# EAGLE design SmartMirror8085 (EAGLE 8.4.3)
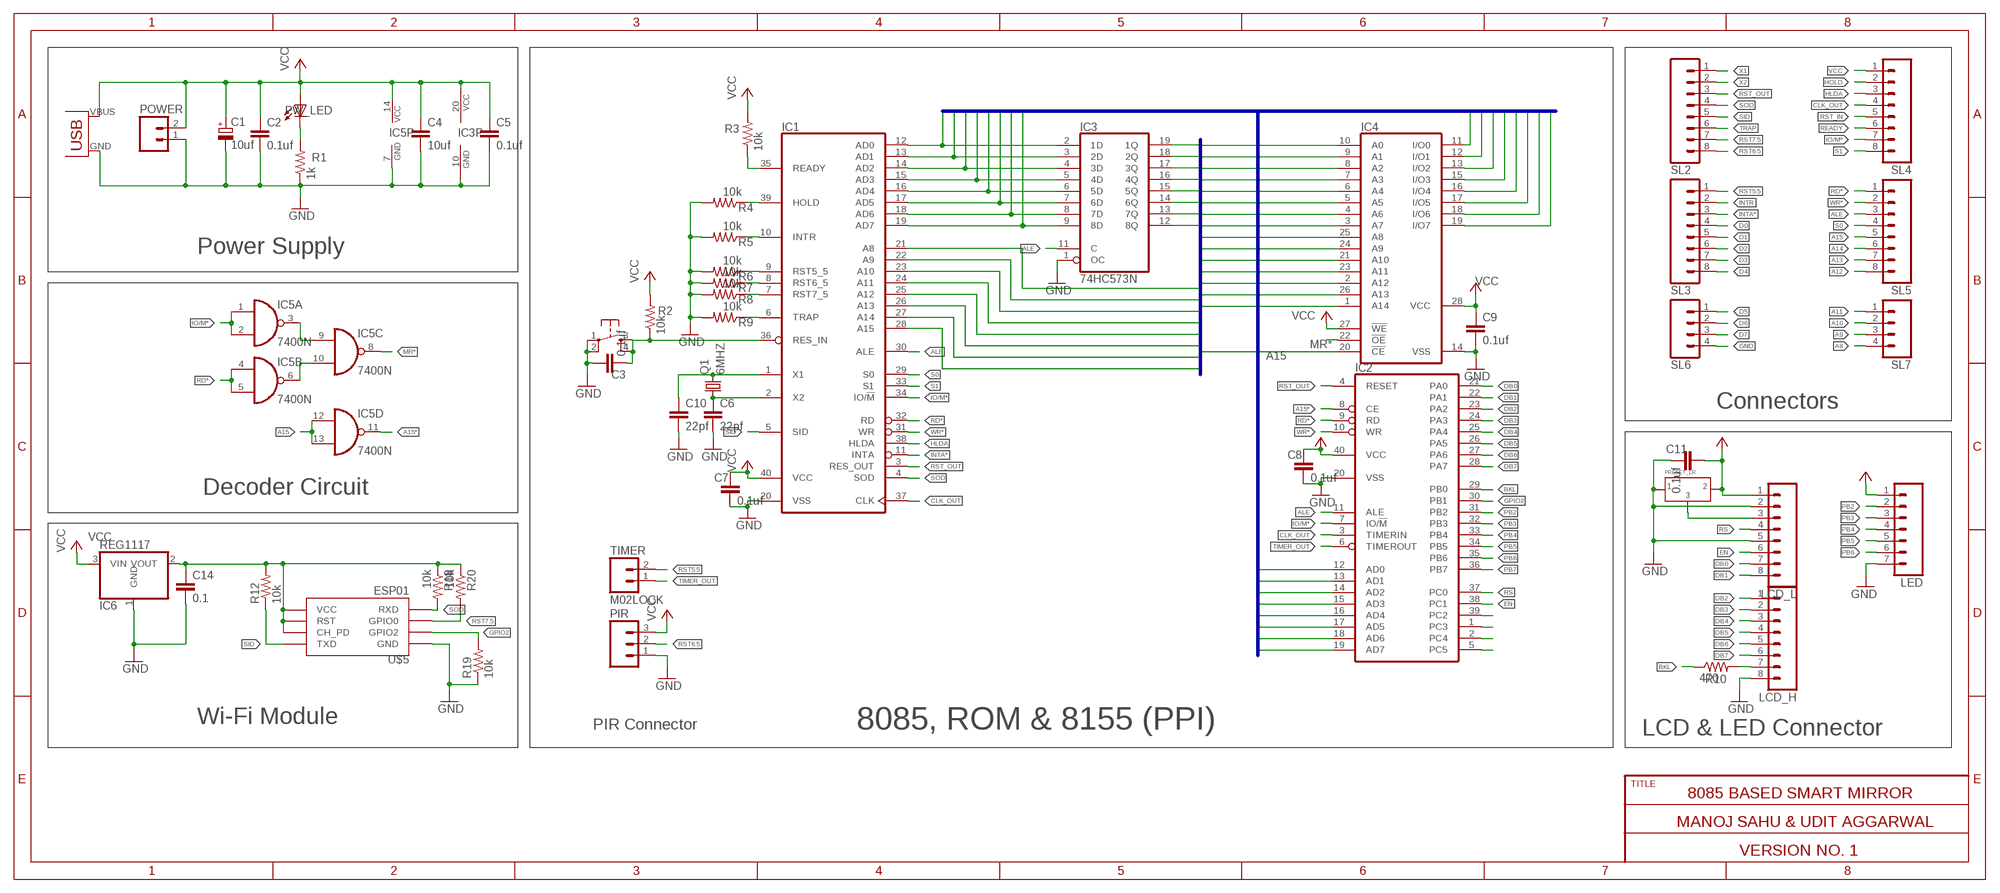
[diagram p0: schematic, sheet 1]

## Parts
C1  10uf  CPOL-EUE5-8.5  [E5-8,5]
C2  0.1uf  C-EU025-024X044  [C025-024X044]
C3  0.1uf  C-EU025-024X044  [C025-024X044]
C4  10uf  C-EU025-024X044  [C025-024X044]
C5  0.1uf  C-EU025-024X044  [C025-024X044]
C6  22pf  C-EU025-024X044  [C025-024X044]
C7  0.1uf  C-EU025-024X044  [C025-024X044]
C8  0.1uf  C-EU025-024X044  [C025-024X044]
C9  0.1uf  C-EU025-024X044  [C025-024X044]
C10  22pf  C-EU025-024X044  [C025-024X044]
C11  0.1uf  C-EU025-024X044  [C025-024X044]
C14  0.1  C-EU025-024X044  [C025-024X044]
IC1  8085  [DIL40]
IC2  8155  [DIL40]
IC3  74HC573N  [DIL20]
IC4  58C256P  [DIL28-6]
IC5  7400N  [DIL14]
IC6  REG1117  [SOT223]
LCD_H  M08  [08P]
LCD_L  M08  [08P]
LED  M07  [07P]
PIR  M03  [03P]
POWER  M02  [02P]
PW_LED  LED3MM  [LED3MM]
Q1  6MHZ  CRYSTALHC49US  [HC49US]
R1  1k  RESISTOR0207/7  [0207/7]
R2  10k  RESISTOR0207/7  [0207/7]
R3  10k  RESISTOR0207/7  [0207/7]
R4  10k  RESISTOR0207/7  [0207/7]
R5  10k  RESISTOR0207/7  [0207/7]
R6  10k  RESISTOR0207/7  [0207/7]
R7  10k  RESISTOR0207/7  [0207/7]
R8  10k  RESISTOR0207/7  [0207/7]
R9  10k  RESISTOR0207/7  [0207/7]
R10  470  RESISTOR0207/7  [0207/7]
R12  10k  R-US_0207/7  [0207/7]
R18  10k  R-US_0207/7  [0207/7]
R19  10k  R-US_0207/7  [0207/7]
R20  10k  R-US_0207/7  [0207/7]
RESET  OMRON_SWITCH_10-XX  [B3F-10XX]
SL2  M08  [08P]
SL3  M08  [08P]
SL4  M08  [08P]
SL5  M08  [08P]
SL6  M04  [04P]
SL7  M04  [04P]
TIMER  M02LOCK  [1X02_LOCK]
U$2  USB(POWER)  [USB(POWER)]
U$3  PRESET_LR  [PRESET_LR]
U$5  ESP01  [ESP01]

## Nets
3V3: C14.1 IC6.2(VOUT) R12.2 R18.1 R20.1 U$5.CH_PD U$5.RST U$5.VCC
A0: IC3.19(1Q) IC4.10(A0)
A1: IC3.18(2Q) IC4.9(A1)
A2: IC3.17(3Q) IC4.8(A2)
A3: IC3.16(4Q) IC4.7(A3)
A4: IC3.15(5Q) IC4.6(A4)
A5: IC3.14(6Q) IC4.5(A5)
A6: IC3.13(7Q) IC4.4(A6)
A7: IC3.12(8Q) IC4.3(A7)
A8: IC1.21(A8) IC4.25(A8) SL7.4
A9: IC1.22(A9) IC4.24(A9) SL7.3
A10: IC1.23(A10) IC4.21(A10) SL7.2
A11: IC1.24(A11) IC4.23(A11) SL7.1
A12: IC1.25(A12) IC4.2(A12) SL5.8
A13: IC1.26(A13) IC4.26(A13) SL5.7
A14: IC1.27(A14) IC4.1(A14) SL5.6
A15: IC1.28(A15) IC4.20(!CE) IC5.12(D:I0) IC5.13(D:I1) SL5.5
A15*: IC2.8(CE) IC5.11(D:O)
ALE: IC1.30(ALE) IC2.11(ALE) IC3.11(C) SL5.3
BKL: IC2.29(PB0) R10.1
CLK_OUT: IC1.37(CLK) IC2.3(TIMERIN) SL4.4
D0: IC1.12(AD0) IC2.12(AD0) IC3.2(1D) IC4.11(I/O0) SL3.4
D1: IC1.13(AD1) IC2.13(AD1) IC3.3(2D) IC4.12(I/O1) SL3.5
D2: IC1.14(AD2) IC2.14(AD2) IC3.4(3D) IC4.13(I/O2) SL3.6
D3: IC1.15(AD3) IC2.15(AD3) IC3.5(4D) IC4.15(I/O3) SL3.7
D4: IC1.16(AD4) IC2.16(AD4) IC3.6(5D) IC4.16(I/O4) SL3.8
D5: IC1.17(AD5) IC2.17(AD5) IC3.7(6D) IC4.17(I/O5) SL6.1
D6: IC1.18(AD6) IC2.18(AD6) IC3.8(7D) IC4.18(I/O6) SL6.2
D7: IC1.19(AD7) IC2.19(AD7) IC3.9(8D) IC4.19(I/O7) SL6.3
DB0: IC2.21(PA0) LCD_L.7
DB1: IC2.22(PA1) LCD_L.8
DB2: IC2.23(PA2) LCD_H.1
DB3: IC2.24(PA3) LCD_H.2
DB4: IC2.25(PA4) LCD_H.3
DB5: IC2.26(PA5) LCD_H.4
DB6: IC2.27(PA6) LCD_H.5
DB7: IC2.28(PA7) LCD_H.6
EN: IC2.38(PC1) LCD_L.6
GND: C1.- C2.2 C3.1 C4.2 C5.2 C6.2 C7.2 C8.2 C9.2 C10.2 C11.2 C14.2 IC1.20(VSS) IC2.20(VSS) IC3.1(OC) IC3.10(GND) IC4.14(VSS) IC5.7(P:GND) IC6.1(GND) LCD_H.8 LCD_L.2 LCD_L.5 LED.7 PIR.1 POWER.1 R1.1 R4.2 R5.2 R6.2 R7.2 R8.2 R9.2 R19.1 RESET.1(P) RESET.2(P1) SL6.4 U$2.GND U$3.P$1 U$5.GND
GPIO2: IC2.30(PB1) R19.2 U$5.GPIO2
HLDA: IC1.38(HLDA) SL4.3
HOLD: IC1.39(HOLD) R4.1 SL4.2
INTA*: IC1.11(INTA) SL3.3
INTR: IC1.10(INTR) R5.1 SL3.2
IO/M*: IC1.34(IO/!M) IC2.7(IO/!M) IC5.1(A:I0) IC5.2(A:I1) SL4.7
MR*: IC4.22(!OE) IC5.8(C:O)
N$1: IC2.39(PC2)
N$2: LCD_L.3 U$3.P$3
N$3: IC2.1(PC3)
N$4: LCD_H.7 R10.2
N$7: PW_LED.K(C) R1.2
N$8: IC5.3(A:O) IC5.9(C:I0)
N$9: IC5.6(B:O) IC5.10(C:I1)
N$21: IC2.2(PC4)
N$22: IC2.5(PC5)
PB2: IC2.31(PB2) LED.2
PB3: IC2.32(PB3) LED.3
PB4: IC2.33(PB4) LED.4
PB5: IC2.34(PB5) LED.5
PB6: IC2.35(PB6) LED.6
PB7: IC2.36(PB7)
RD*: IC1.32(RD) IC2.9(RD) IC5.4(B:I0) IC5.5(B:I1) SL5.1
READY: IC1.35(READY) R3.1 SL4.6
RS: IC2.37(PC0) LCD_L.4
RST5.5: IC1.9(RST5_5) R6.1 SL3.1 TIMER.2
RST6.5: IC1.8(RST6_5) PIR.2 R7.1 SL2.8
RST7.5: IC1.7(RST7_5) R8.1 R20.2 SL2.7 U$5.GPIO0
RST_IN: C3.2 IC1.36(RES_IN) R2.1 RESET.3(S) RESET.4(S1) SL4.5
RST_OUT: IC1.3(RES_OUT) IC2.4(RESET) SL2.3
S0: IC1.29(S0) SL5.4
S1: IC1.33(S1) SL4.8
SID: IC1.5(SID) R12.1 SL2.5 U$5.TX(TXD)
SOD: IC1.4(SOD) R18.2 SL2.4 U$5.RX(RXD)
TIMER_OUT: IC2.6(TIMEROUT) TIMER.1
TRAP: IC1.6(TRAP) R9.1 SL2.6
VCC: C1.+ C2.1 C4.1 C5.1 C7.1 C8.1 C9.1 C11.1 IC1.40(VCC) IC2.40(VCC) IC3.20(VCC) IC4.27(!WE) IC4.28(VCC) IC5.14(P:VCC) IC6.3(VIN) LCD_L.1 LED.1 PIR.3 POWER.2 PW_LED.A R2.2 R3.2 SL4.1 U$2.VBUS(VCC) U$3.P$2
WR*: IC1.31(WR) IC2.10(WR) SL5.2
X1: C10.1 IC1.1(X1) Q1.2 SL2.1
X2: C6.1 IC1.2(X2) Q1.1 SL2.2

## Buses
D[0..7]
A[0..15]

## Notes on the sheet
- Power Supply
- Connectors
- Decoder Circuit
- Wi-Fi Module
- PIR Connector | 8085, ROM & 8155 (PPI)
- LCD & LED Connector
- TITLE
- 8085 BASED SMART MIRROR
- MANOJ SAHU & UDIT AGGARWAL
- VERSION NO. 1

## Library data of the parts
C1 = rcl:CPOL-EU: POLARIZED CAPACITOR, European symbol
C2-C11 C14 = rcl:C-EU: CAPACITOR, European symbol
IC1 = micro-intel:8085: MICROCOMPUTER/PERIPHERAL DEVICE; OC_FARNELL: unknown; OC_NEWARK: unknown
IC2 = micro-intel:8155: MICROCOMPUTER/PERIPHERAL DEVICE; OC_FARNELL: unknown; OC_NEWARK: unknown
IC3 = 74xx-us:74*573: 8-bit D latch BUS DRIVER
IC4 = memory-hitachi:58C256P: MEMORY; MPN: HN58C256AP85E; OC_FARNELL: 1496447; OC_NEWARK: 61M6616
IC5 = 74xx-eu:74*00: Quad 2-input NAND gate
IC6 = CEDT_JANUARY_2015_v5:REG1117: 800mA and 1A Low Dropout (LDO) Positive Regulator 1.8V, 2.5V, 2.85V, 3.3V, 5V, and Adj
LCD_H LCD_L SL2-SL5 = con-amp-quick:M08: AMP QUICK CONNECTOR; OC_FARNELL: unknown; OC_NEWARK: unknown
LED = con-amp-quick:M07: AMP QUICK CONNECTOR; OC_FARNELL: unknown; OC_NEWARK: unknown
PIR = con-amp-quick:M03: AMP QUICK CONNECTOR; OC_FARNELL: unknown; OC_NEWARK: unknown
POWER = CEDT_JANUARY_2015_v7:M02: AMP QUICK CONNECTOR
PW_LED = CEDT_JANUARY_2015_v7:LED
Q1 = CEDT_JANUARY_2015_v7:CRYSTAL: Crystals Various standard crystals. Proven footprints. Spark Fun Electronics SKU : COM-00534
R1-R10 = CEDT_JANUARY_2015_v7:RESISTOR
R12 R18-R20 = rcl:R-US_: RESISTOR, American symbol
RESET = CEDT_JANUARY_2015_v7:OMRON_SWITCH
SL6 SL7 = con-amp-quick:M04: AMP QUICK CONNECTOR; OC_FARNELL: unknown; OC_NEWARK: unknown
TIMER = SparkFun-Connectors:M02: Standard 2-pin 0.1" header. Use with - straight break away headers ( PRT-00116) - right angle break away headers (PRT-00553) - swiss pins (PRT-00743) - machine pins (PRT-00117) - female headers (PRT-00115) Molex polarized connector foot print use with: PRT-08233 with associated crimp pins and housings. 2.54_SCREWTERM for use with PRT-10571. 3.5mm Screw Terminal footprints for PRT-08084 5mm Screw Terminal footprints for use with PRT-08432
U$2 = CEDT_JANUARY_2015_v7:USB(POWER)
U$3 = CEDT_JANUARY_2015_v7:PRESET_LR
U$5 = esp8266modules:ESP01: ESP8266 Wifi module 01

## Net classes
0 default: width 0.406 mm, clearance 0.305 mm
1 VCC: width 0.61 mm, clearance 0.305 mm to class 0, clearance 0.305 mm
2 GND: width 0.61 mm, clearance 0.305 mm to class 0, clearance 0.305 mm to class 1, clearance 0.305 mm

## Board
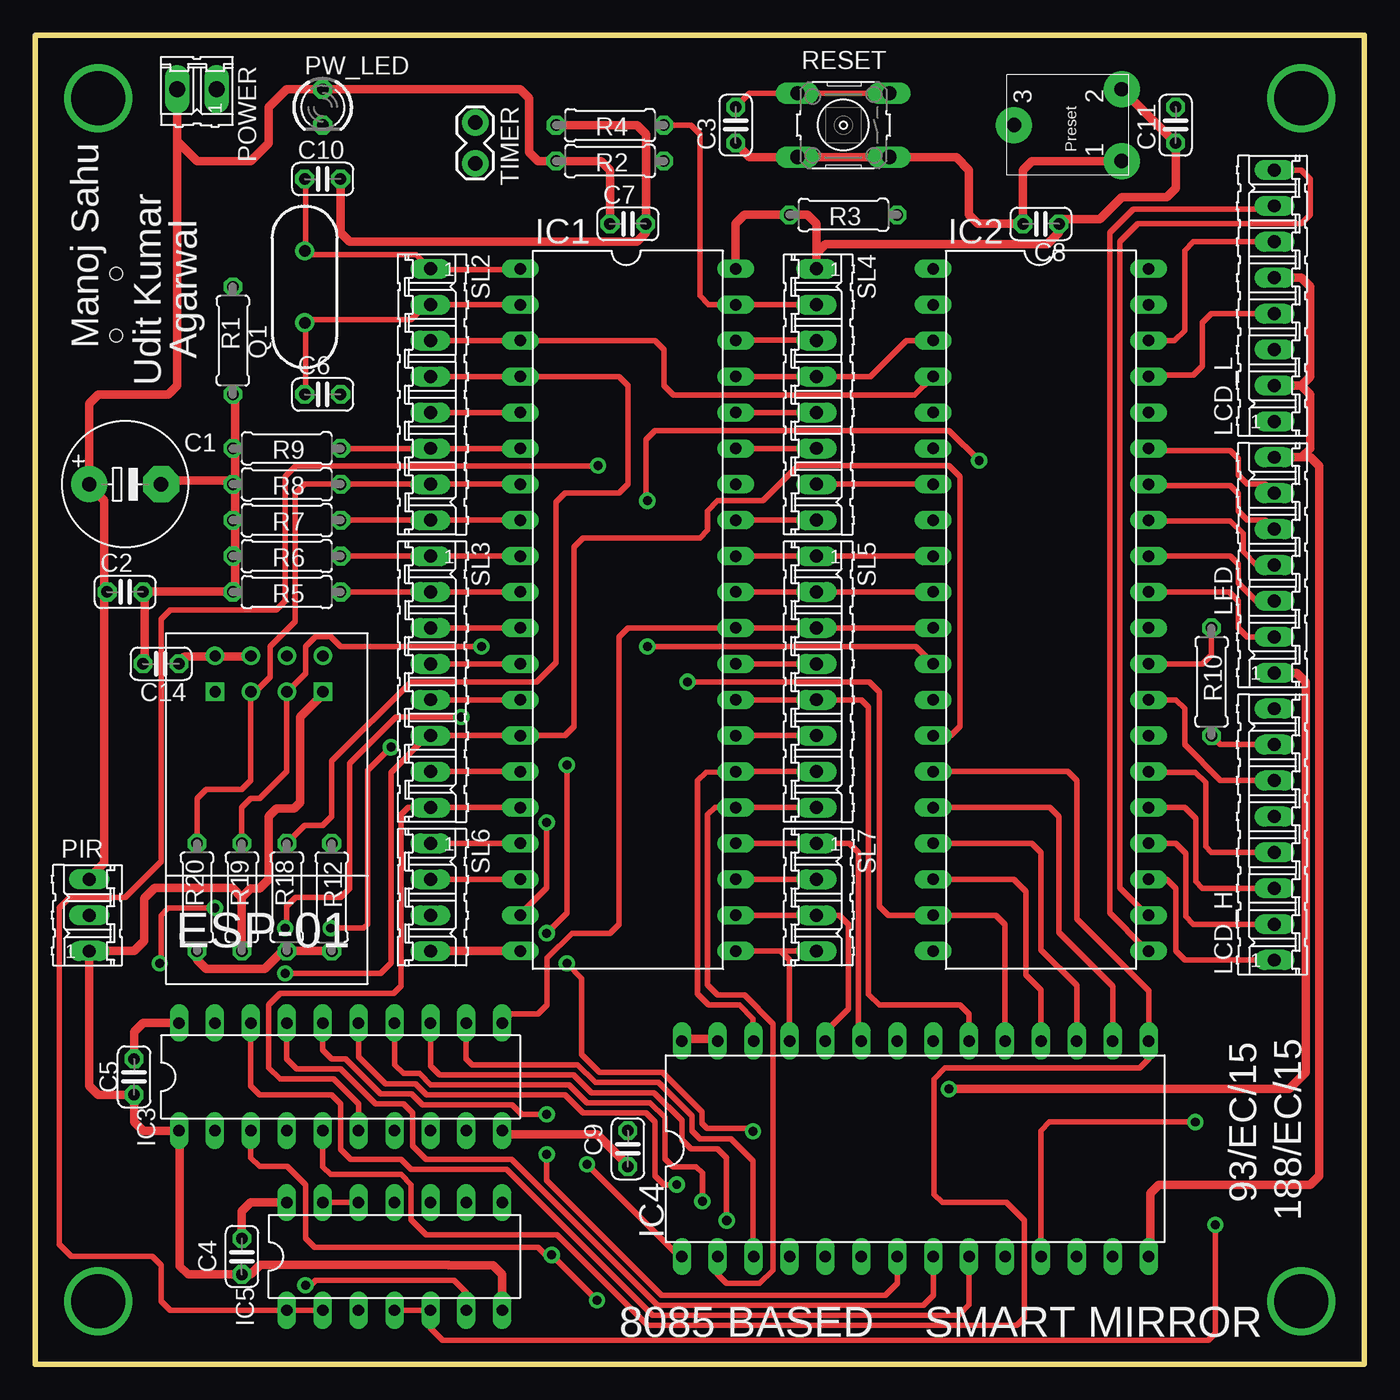
[diagram p1: board, top side]
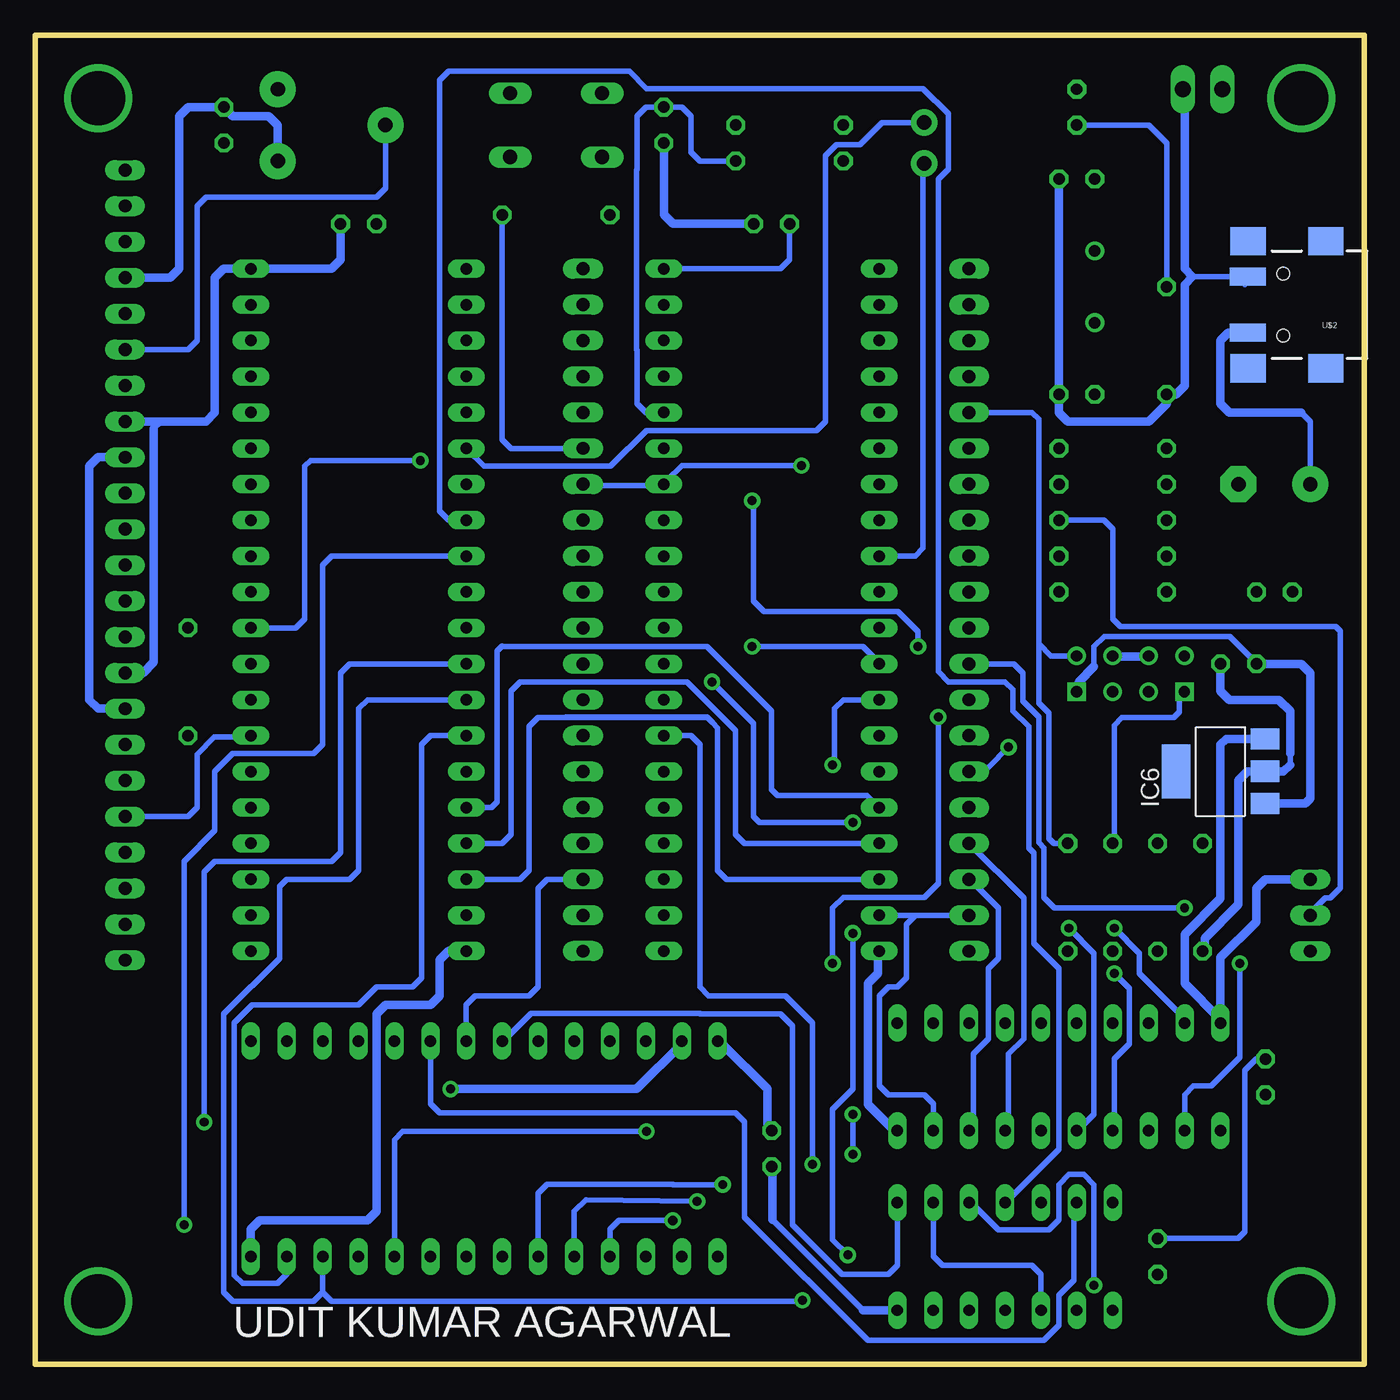
[diagram p2: board, bottom side, seen from below]

Size 93.98 x 93.98 mm. Coordinates in mm from the lower left corner, seen from the top.
Outline: 0,0 0,93.98 93.98,93.98 93.98,0 0,0
Copper layers (1*16): Top 0.035mm / dielectric 1.5mm / Bottom 0.035mm
Design rules "drcsetting": minimum track width 12mil, minimum drill 25mil, track to track 8mil, track to pad 8mil, pad to pad 8mil, via to via 8mil, smd to smd 8mil, copper to edge 40mil, drill to drill 12mil, minimum pad ring 10mil, minimum via ring 10mil, stop-mask expansion 4mil, vias tented up to drill 0mil, thermal gap 10mil

### Footprints (pad centres in the part's own frame; a part is rotated, then mirrored left to right if it is on the bottom)
E5-8,5 = drill 1.016 pad 2.54: + -2.54,0 | drill 1.016 pad 2.54 octagon: - 2.54,0
C025-024X044 = drill 0.813 octagon: 1 -1.27,0; 2 1.27,0
DIL40 = drill 0.813 long: 1 -24.13,-7.62; 2 -21.59,-7.62; 3 -19.05,-7.62; 4 -16.51,-7.62; 5 -13.97,-7.62; 6 -11.43,-7.62; 7 -8.89,-7.62; 8 -6.35,-7.62; 9 -3.81,-7.62; 10 -1.27,-7.62; 11 1.27,-7.62; 12 3.81,-7.62; 13 6.35,-7.62; 14 8.89,-7.62; 15 11.43,-7.62; 16 13.97,-7.62; 17 16.51,-7.62; 18 19.05,-7.62; 19 21.59,-7.62; 20 24.13,-7.62; 21 24.13,7.62; 22 21.59,7.62; 23 19.05,7.62; 24 16.51,7.62; 25 13.97,7.62; 26 11.43,7.62; 27 8.89,7.62; 28 6.35,7.62; 29 3.81,7.62; 30 1.27,7.62; 31 -1.27,7.62; 32 -3.81,7.62; 33 -6.35,7.62; 34 -8.89,7.62; 35 -11.43,7.62; 36 -13.97,7.62; 37 -16.51,7.62; 38 -19.05,7.62; 39 -21.59,7.62; 40 -24.13,7.62
DIL20 = drill 0.813 long: 1 -11.43,-3.81; 2 -8.89,-3.81; 3 -6.35,-3.81; 4 -3.81,-3.81; 5 -1.27,-3.81; 6 1.27,-3.81; 7 3.81,-3.81; 8 6.35,-3.81; 9 8.89,-3.81; 10 11.43,-3.81; 11 11.43,3.81; 12 8.89,3.81; 13 6.35,3.81; 14 3.81,3.81; 15 1.27,3.81; 16 -1.27,3.81; 17 -3.81,3.81; 18 -6.35,3.81; 19 -8.89,3.81; 20 -11.43,3.81
DIL28-6 = drill 0.813 long: 1 -16.51,-7.62; 2 -13.97,-7.62; 3 -11.43,-7.62; 4 -8.89,-7.62; 5 -6.35,-7.62; 6 -3.81,-7.62; 7 -1.27,-7.62; 8 1.27,-7.62; 9 3.81,-7.62; 10 6.35,-7.62; 11 8.89,-7.62; 12 11.43,-7.62; 13 13.97,-7.62; 14 16.51,-7.62; 15 16.51,7.62; 16 13.97,7.62; 17 11.43,7.62; 18 8.89,7.62; 19 6.35,7.62; 20 3.81,7.62; 21 1.27,7.62; 22 -1.27,7.62; 23 -3.81,7.62; 24 -6.35,7.62; 25 -8.89,7.62; 26 -11.43,7.62; 27 -13.97,7.62; 28 -16.51,7.62
DIL14 = drill 0.813 long: 1 -7.62,-3.81; 2 -5.08,-3.81; 3 -2.54,-3.81; 4 0,-3.81; 5 2.54,-3.81; 6 5.08,-3.81; 7 7.62,-3.81; 8 7.62,3.81; 9 5.08,3.81; 10 2.54,3.81; 11 0,3.81; 12 -2.54,3.81; 13 -5.08,3.81; 14 -7.62,3.81
SOT223 = smd 1.499 x 2.007: 1 -2.261,-3.15; 2 0.025,-3.15; 3 2.311,-3.15 | smd 3.81 x 2.007: 4 0,3.15
08P = drill 0.914 long: 1 -8.89,0; 2 -6.35,0; 3 -3.81,0; 4 -1.27,0; 5 1.27,0; 6 3.81,0; 7 6.35,0; 8 8.89,0
07P = drill 0.914 long: 1 -7.62,0; 2 -5.08,0; 3 -2.54,0; 4 0,0; 5 2.54,0; 6 5.08,0; 7 7.62,0
03P = drill 0.914 long: 1 -2.54,0; 2 0,0; 3 2.54,0
02P = drill 1.143 long: 1 -1.397,0; 2 1.397,0
LED3MM = drill 0.813 octagon: A -1.27,0; K 1.27,0
HC49US = drill 0.813: 1 -2.54,0; 2 2.54,0
0207/7 = drill 0.813 octagon: 1 -3.81,0; 2 3.81,0
B3F-10XX = drill 1.016 long: 1 -3.251,2.261; 2 3.251,2.261; 3 -3.251,-2.261; 4 3.251,-2.261
04P = drill 0.914 long: 1 -3.81,0; 2 -1.27,0; 3 1.27,0; 4 3.81,0
1X02_LOCK = drill 1.016 pad 1.88: 1 -0.178,0; 2 2.718,0
USB(POWER) = smd 2.54 x 1.27: GND 2.5,-1.981; VBUS 2.5,1.981 | smd 2.5 x 2: GND@1 -3,-4.5; GND@2 -3,4.5; GND@3 2.5,4.5; GND@4 2.5,-4.5 | hole 0.9: 0,2.2; 0,-2.2
PRESET_LR = drill 1.016 pad 2.54: P$1 -2.54,-3.81; P$2 2.54,-3.81; P$3 0,3.81
ESP01 = drill 0.8: CH_PD -1.285,-8.178; GPIO0 1.255,-5.638; GPIO2 -1.285,-5.638; RST 1.255,-8.178; TX -3.825,-8.178; VCC 3.795,-8.178 | drill 0.8 square: GND -3.825,-5.638; RX 3.795,-5.638

### Placement (x,y rotation side)
C1  6.35,62.23 0 top
C2  6.35,54.61 0 top
C3  49.53,87.63 90 top
C4  14.61,7.62 270 top
C5  6.99,20.32 270 top
C6  20.32,68.58 0 top
C7  41.91,80.64 0 top
C8  71.12,80.64 180 top
C9  41.91,15.24 270 top
C10  20.32,83.82 0 top
C11  80.64,87.63 90 top
C14  8.89,49.53 180 top
IC1  41.91,53.34 270 top
IC2  71.12,53.34 270 top
IC3  21.59,20.32 0 top
IC4  62.23,15.24 0 top
IC5  25.4,7.62 0 top
IC6  10.16,41.91 90 bottom
LCD_H  87.63,37.47 90 top
LCD_L  87.63,75.56 90 top
LED  87.63,56.52 90 top
PIR  3.81,31.75 90 top
POWER  11.43,90.17 180 top
PW_LED  20.32,88.9 270 top
Q1  19.05,76.2 90 top
R1  13.97,72.39 90 top
R2  40.64,85.09 180 top
R3  57.15,81.28 180 top
R4  40.64,87.63 180 top
R5  17.78,54.61 180 top
R6  17.78,57.15 180 top
R7  17.78,59.69 180 top
R8  17.78,62.23 180 top
R9  17.78,64.77 180 top
R10  83.19,48.26 270 top
R12  20.95,33.02 270 top
R18  17.78,33.02 90 top
R19  14.61,33.02 90 top
R20  11.43,33.02 90 top
RESET  57.15,87.63 180 top
SL2  27.94,68.58 270 top
SL3  27.94,48.26 270 top
SL4  55.24,68.58 270 top
SL5  55.24,48.26 270 top
SL6  27.94,33.02 270 top
SL7  55.24,33.02 270 top
TIMER  31.11,87.63 270 top
U$2  5.71,74.93 180 bottom
U$3  73.03,87.63 90 top
U$5  16.51,41.91 180 top

### Tracks (layer width: path | path; a pad name or v marks a point on that pad's centre or on a via)
3V3
  Top 0.406: 12.7,50.04 U$5.VCC | R18.1 17.48,29.21
  Top 0.61: U$5.VCC 13.06,50.04 15.19,50.04 U$5.RST | 12.7,50.04 10.57,50.04 10.21,49.68 C14.1 | R20.1 11.43,28.57 12.06,27.94 16.2,27.94 17.48,29.21 | R18.1 R12.2
  Bottom 0.406: 17.68,50.04 U$5.CH_PD | 15.54,50.04 U$5.RST | 6.3,42.22 7.01,42.22 IC6.2 7.04,41.91 | 5.23,42.39 5.23,43.18 5.24,43.19
  Bottom 0.61: 15.54,50.04 17.68,50.04 | R20.1 11.28,29.41 11.28,30.12 8.89,32.51 8.89,41.27 8.26,41.91 7.04,41.91 5.71,41.91 5.23,42.39 | C14.1 10.16,47.62 9.53,46.99 6.04,46.99 5.24,46.2 5.24,43.19
A0  (via drill 0.64)
  Top 0.406: v30.12,45.77 25.5,45.77 22.23,42.49 22.23,33.66 21.59,33.02 18.41,33.02 17.78,32.38 17.78,30.94 v17.68,30.84 | v50.75,16.46 50.55,16.66 47.5,16.66 47.14,17.02 47.14,17.84 44.36,20.62 39.91,20.62 38.64,21.89 38.64,27.3 v37.59,28.35
  Bottom 0.406: v17.68,30.84 15.9,29.06 15.9,27.64 12.7,24.43 IC3.19 | v30.12,45.77 30.12,34.01 31.11,33.02 36.83,33.02 37.59,32.26 v37.59,28.35 | IC4.10 68.58,15.88 68,16.46 v50.75,16.46
A1
  Top 0.406: IC4.9 66.04,4.19 65.3,3.45 43.64,3.45 33.33,13.77 26.57,13.77 25.86,14.48 22.3,14.48 21.59,15.19 21.59,18.41 20.95,19.05 15.88,19.05 15.24,19.68 IC3.18
A2
  Top 0.406: IC3.17 17.78,21.59 18.49,20.88 21.59,20.88 24.05,18.41 26.04,18.41 26.67,17.78 26.67,15.44 27.64,14.48 33.68,14.48 43.99,4.17 62.8,4.17 63.5,4.86 IC4.8
A3  (via drill 0.64)
  Top 0.406: v36.17,17.68 34.39,17.68 33.73,18.34 27.38,18.34 26.59,19.13 24.43,19.13 21.96,21.59 20.95,21.59 20.32,22.23 IC3.16 | IC4.7 60.96,5.71 60.12,4.88 44.29,4.88 36.17,12.99 v36.17,14.83
  Bottom 0.406: v36.17,17.68 v36.17,14.83
A4  (via drill 0.64)
  Top 0.406: 22.86,22.86 IC3.15 22.86,21.74 24.77,19.84 26.89,19.84 27.68,19.05 37.47,19.05 38.73,17.78 43.18,17.78 43.81,17.14 43.81,13.34 44.45,12.7 v45.36,12.7
  Bottom 0.406: IC4.6 58.42,12.06 57.77,12.71 48.88,12.71 48.87,12.7 v45.36,12.7
A5  (via drill 0.64)
  Top 0.406: IC3.14 25.4,21.18 26.04,20.55 27.18,20.55 27.97,19.76 37.76,19.76 39.03,18.49 43.48,18.49 44.53,17.44 44.53,14.53 45.09,13.97 46.74,13.97 47.17,13.54 v47.17,11.51
  Bottom 0.406: v47.17,11.51 55.04,11.63 55.88,10.79 IC4.5
A6  (via drill 0.65)
  Top 0.406: IC3.13 27.94,21.11 28.57,20.47 38.05,20.47 39.32,19.2 43.77,19.2 45.72,17.25 45.72,15.88 46.35,15.24 48.26,15.24 48.9,14.61 v48.9,10.16
  Bottom 0.406: 53.34,8.89 IC4.4 53.34,9.53 52.7,10.16 v48.9,10.16
A7
  Top 0.406: IC4.3 50.75,7.72 50.75,14.39 49.19,15.95 46.99,15.95 46.43,16.51 46.43,17.55 44.06,19.91 39.62,19.91 38.35,21.18 30.89,21.18 30.48,21.59 IC3.12
A8
  Top 0.406: 53.59,23.01 IC4.25 53.34,28.57 52.7,29.21 | IC1.21 52.7,29.21 | 52.7,29.21 SL7.4
A9
  Top 0.406: IC4.24 55.88,23.5 57.51,25.12 57.51,31.11 56.87,31.75 SL7.3 IC1.22
A10
  Top 0.406: IC1.23 SL7.2
  Bottom 0.406: IC4.21 63.5,25.4 62.87,26.04 59.05,26.04 58.42,26.67 58.42,33.66 57.78,34.29 SL7.2
A11
  Top 0.406: IC4.23 58.22,23.01 58.22,36.2 57.58,36.83 SL7.1 IC1.24
A12
  Top 0.406: SL5.8 IC1.25 48.06,39.37 47.55,38.86 47.55,26.82 48.26,26.11 50.14,26.11 52.17,24.08 52.17,6.66 51.23,5.71 48.9,5.71 48.26,6.35 IC4.2
A13
  Top 0.406: IC4.26 50.75,23.01 50.75,24.43 49.78,25.4 47.62,25.4 46.84,26.19 46.84,41.27 47.42,41.86 IC1.26 SL5.7
A14  (via drill 0.64)
  Top 0.406: v39.01,14.12 45.41,7.72 IC4.1 | IC1.27 SL5.6
  Bottom 0.406: v39.01,14.12 39.01,24.13 40.92,26.04 46.35,26.04 46.99,26.67 46.99,43.81 47.62,44.45 IC1.27 49.33,44.35
A15
  Top 0.406: 66.04,24.08 IC4.20 66.04,24.77 65.41,25.4 59.69,25.4 58.93,26.16 58.93,46.48 58.42,46.99 SL5.5 IC1.28 | IC5.13 IC5.12
  Bottom 0.406: IC4.20 66.04,18.41 65.41,17.78 44.45,17.78 43.81,17.14 43.81,10.39 35.1,1.68 22.66,1.68 21.59,2.74 21.59,4.88 20.52,5.94 20.52,11.28 IC5.13
A15*
  Bottom 0.406: IC5.11 25.15,11.63 21.59,15.19 21.59,27.99 23.37,29.77 23.37,36.17 23.72,36.52 23.72,45.09 24.84,46.2 24.84,47.7 25.4,48.26 29.41,48.26 30.12,48.97 30.12,83.82 29.41,84.53 29.41,88.44 31.19,90.22 50.75,90.22 51.97,91.44 64.77,91.44 65.41,90.81 65.41,60.33 64.77,59.69 63.6,59.69 63.55,59.64 IC2.8
ALE
  Top 0.406: IC2.11 SL5.3 IC1.30 41.91,52.07 41.27,51.44 41.27,31.11 40.64,30.48 37.95,30.48 36.2,28.73 36.2,25.4 35.56,24.77 33.66,24.77 IC3.11
BKL
  Top 0.406: R10.1 83.19,50.16 82.55,49.53 IC2.29
CLK_OUT
  Top 0.406: IC1.37 SL4.4 59.05,69.85 61.59,72.39 IC2.3
D0  (via drill 0.64)
  Top 0.406: v43.28,50.75 62.28,50.75 IC2.12 | IC4.11 71.12,16.51 71.73,17.12 v82.04,17.12 | SL3.4 IC1.12 | v12.7,32.26 9.4,32.26 8.89,31.75 8.89,28.45 v8.79,28.35
  Bottom 0.406: IC3.2 12.7,19.05 12.06,19.68 10.79,19.68 8.79,21.69 v8.79,28.35 | v43.28,50.75 35.46,50.75 34.39,49.68 IC1.12 | v12.7,32.26 21.89,32.26 22.66,33.02 22.66,36.52 23.01,36.88 23.01,45.77 24.13,46.89 24.13,48.9 24.77,49.53 SL3.4 | v82.04,17.12 82.04,34.8 81.28,35.56 73.03,35.56 72.39,36.2 72.39,48.9 71.75,49.53 IC2.12
D1  (via drill 0.64)
  Top 0.406: v39.73,4.52 v36.52,7.72 36.09,7.72 35.56,8.26 19.74,8.26 19.1,8.89 19.1,12.7 17.8,13.99 15.85,13.99 15.24,14.61 IC3.3 | v37.59,42.37 37.59,31.9 v36.17,30.48 | SL3.5 IC1.13
  Bottom 0.406: v36.17,30.48 36.17,19.46 37.59,18.03 37.59,8.79 v36.52,7.72 | IC1.13 36.83,46.99 37.47,46.35 37.47,42.49 v37.59,42.37 | IC2.13 70.48,46.99 71.12,46.35 71.12,34.92 71.75,34.29 76.2,34.29 76.71,33.78 76.71,28.7 80.64,24.77 80.64,5.08 80.01,4.45 74.3,4.45 73.66,5.08 | IC4.12 73.66,5.08 | 73.66,5.08 73.03,4.45 39.8,4.45 v39.73,4.52
D2  (via drill 0.64)
  Top 0.406: v17.68,27.64 24.41,27.64 25.15,28.37 25.15,41.86 27.64,44.35 SL3.6 IC1.14 37.47,44.45 38.1,45.09 38.1,57.78 38.73,58.42 46.99,58.42 47.55,58.98 47.55,60.35 48.26,61.06 51.46,61.06 53.95,63.55 64.62,63.55 65.41,62.76 65.41,45.09 64.77,44.45 IC2.14
  Bottom 0.406: v17.68,27.64 16.61,26.57 16.61,22.66 17.68,21.59 17.68,16.61 IC3.4 | IC2.14 66.04,44.45 66.67,43.81 66.67,27.3 67.31,26.67 69.85,26.67 71.12,25.4 78.64,25.4 79.91,24.13 79.91,6.3 79.32,5.71 76.83,5.71 76.2,6.35 IC4.13
D3  (via drill 0.64)
  Top 0.406: IC3.5 20.32,13.97 20.88,13.41 25.86,13.41 26.57,12.7 26.57,10.21 27.64,9.14 36.88,9.14 43.28,2.74 69.42,2.74 69.95,3.28 69.95,10.16 68.68,11.43 64.14,11.43 63.54,12.03 63.54,20.16 64.34,20.95 78.11,20.95 78.74,21.59 IC4.15 78.74,26.42 73.66,31.5 73.66,41.27 73.03,41.91 IC2.15 | SL3.7 IC1.15 | v20.88,30.84 23.22,30.84 23.5,31.11 23.5,41.99 v25.15,43.64
  Bottom 0.406: v25.15,43.64 26.57,42.22 27.64,42.22 SL3.7 | v20.88,30.84 19.1,29.06 19.1,17.68 20.17,16.61 IC3.5
D4
  Top 0.406: IC1.16 SL3.8 26.36,39.37 25.86,38.86 25.86,26.75 25.32,26.21 17.32,26.21 16.51,25.4 16.51,20.95 17.3,20.17 21.11,20.17 22.86,18.41 IC3.6 | IC2.16 71.75,39.37 72.39,38.73 72.39,30.53 76.2,26.72 IC4.16
  Bottom 0.406: 63.2,39.37 IC2.16 61.71,39.37 61.34,39.75 61.34,50.42 60.96,50.8 60.91,50.75 56.79,50.75 56.52,50.75 46.48,50.75 41.91,46.18 41.91,40.64 41.5,40.23 35.15,40.23 IC1.16
D5
  Top 0.406: IC2.17 70.48,36.83 71.12,36.2 71.12,29.31 73.66,26.77 IC4.17 | SL6.1 IC1.17
  Bottom 0.406: SL6.1 24.08,32.97 24.08,23.01 25.15,21.95 25.15,16.61 IC3.7 | 63.2,36.88 IC2.17 60.96,36.83 60.33,37.47 60.33,47.62 59.69,48.26 47.9,48.26 44.45,44.81 44.45,37.47 43.81,36.83 IC1.17
D6
  Top 0.406: IC2.18 69.22,34.29 70.07,33.44 70.07,27.52 71.12,26.47 IC4.18 | SL6.2 IC1.18
  Bottom 0.406: IC3.8 27.64,16.61 27.64,21.95 26.57,23.01 26.57,27.99 25.86,28.7 25.86,32.26 27.64,34.04 SL6.2 | 56.44,45.77 46.48,45.77 46.43,45.72 | 35.1,34.39 34.39,34.39 IC1.18 45.09,34.29 45.72,34.92 45.72,45.01 46.08,45.36 46.43,45.72 | 63.2,34.39 IC2.18 59.69,34.29 59.05,34.92 59.05,45.09 58.42,45.72 46.43,45.72
D7  (via drill 0.64)
  Top 0.406: v46.13,48.26 58.98,48.26 59.69,47.55 59.69,32.38 60.33,31.75 IC2.19 67.94,31.75 68.58,31.11 IC4.19 | v36.17,38.3 36.17,33.68 34.39,31.9 IC1.19
  Bottom 0.406: IC3.9 30.48,18.41 31.11,19.05 33.66,19.05 34.29,19.68 34.29,26.04 33.66,26.67 33.02,26.67 32.38,27.3 32.38,31.11 31.75,31.75 | SL6.3 31.75,31.75 | 31.75,31.75 IC1.19 | v36.17,38.3 42.75,38.3 43.18,38.73 43.18,45.31 v46.13,48.26
DB0
  Top 0.406: IC2.21 78.49,29.41 76,31.9 76,80.03 77.65,81.69 87.38,81.69 LCD_L.7
DB1
  Top 0.406: IC2.22 78.49,31.9 76.71,33.68 76.71,79.38 77.98,80.64 89.53,80.64 90.17,81.28 90.17,83.82 89.53,84.45 LCD_L.8
DB2
  Top 0.406: LCD_H.1 81.28,28.57 80.64,29.21 80.64,33.66 80.01,34.29 IC2.23
DB3
  Top 0.406: IC2.24 80.64,36.83 81.36,36.12 81.36,31.67 81.92,31.11 LCD_H.2
DB4
  Top 0.406: IC2.25 81.28,39.37 82.07,38.58 82.07,34.14 82.55,33.66 LCD_H.3
DB5
  Top 0.406: IC2.26 78.84,41.86 82.04,41.86 82.78,41.12 82.78,36.6 83.19,36.2 LCD_H.4
DB6
  Bottom 0.406: IC2.27 78.84,44.35 81.33,44.35 82.55,43.13 82.55,39.37 83.19,38.73 LCD_H.5
DB7
  Top 0.406: LCD_H.6 83.82,41.27 81.28,43.81 81.28,46.35 80.64,46.99 IC2.28
EN
  Top 0.406: IC2.38 80.57,72.39 81.28,73.1 81.28,78.74 81.92,79.38 LCD_L.6
GND
  Top 0.406: 41.86,14.12 C9.2 | 7.72,54.3 C2.2 7.72,54.66 | 7.72,49.68 C14.2 | 14.12,54.66 R5.2 13.77,54.66 | 14.12,59.99 R7.2 14.12,59.64 | 14.12,62.13 R8.2 14.12,62.48 | 14.12,64.62 R9.2 14.12,64.97 | 14.12,57.15 R6.2 | 14.12,68.53 R1.1 | 69.6,80.97 C8.2 | 78.84,7.72 IC4.14 | 29.23,6.99 29.21,7.01 | 10.21,16.46 IC3.1
  Top 0.61: 41.86,14.12 39.73,16.26 33.33,16.26 IC3.10 | 7.72,49.68 7.72,54.3 | 14.12,54.66 14.12,57.15 14.12,59.64 | 14.12,62.13 14.12,59.99 | 14.12,62.48 14.12,64.62 | C1.- 9.14,62.48 13.77,62.48 R8.2 | 14.12,68.53 14.12,64.97 | 13.77,54.66 7.72,54.66 | 29.21,7.01 15.9,7.01 15.24,6.35 C4.2 10.79,6.35 10.21,6.93 10.21,16.46 | 78.84,7.72 78.84,12.06 79.48,12.7 90.17,12.7 90.81,13.34 90.81,63.5 90.17,64.14 89.53,64.14 | IC5.7 33.02,6.35 32.38,6.99 29.23,6.99 | 89.53,69.22 90.17,69.85 90.17,76.2 89.53,76.83 LCD_L.5 | 89.53,69.22 LCD_L.2 | U$3.P$1 70.48,85.09 69.85,84.45 C8.2 66.67,80.64 66.04,81.28 66.04,84.45 65.13,85.37 RESET.1 RESET.2 50.52,85.37 C3.1 | C10.2 21.59,80.01 22.23,79.38 42.55,79.38 43.18,80.01 C7.2 43.18,87 42.55,87.63 R4.2 | R19.1 14.61,33.02 | 14.61,33.02 13.95,33.68 8.43,33.68 7.7,32.94 7.7,29.92 6.99,29.21 PIR.1 3.81,19.68 4.45,19.05 C5.2 6.99,17.14 7.62,16.51 IC3.1 | 14.61,33.02 15.24,33.66 15.88,33.66 16.51,34.29 16.51,38.73 17.07,39.29 18.31,39.29 18.75,39.73 18.75,45.77 20.34,47.36 U$5.GND | SL6.4 IC1.20 | 89.53,64.14 LED.7 | 89.53,69.22 90.17,68.58 90.17,64.77 89.53,64.14
  Bottom 0.406: 41.86,10.21 35.46,3.81 | 41.86,13.77 C9.2 | 34.39,29.06 IC1.20 | 33.33,16.61 IC3.10 | 20.17,48.26 20.17,47.55 | 19.1,49.33 19.1,50.75 18.39,51.46 9.5,51.46 7.72,49.68 C14.2 | U$2.GND 8.43,76.71 8.43,76.35 U$2.GND | POWER.1 12.76,90.11 12.7,90.05 | 80.62,88.8 C11.2 | 87.38,77.06 LCD_L.5 | U$2.GND 12.14,76.91
  Bottom 0.61: 35.46,3.81 IC5.7 | 41.86,13.77 41.86,10.21 | 34.39,29.06 34.39,27.64 35.1,26.92 35.1,18.39 33.33,16.61 | 7.37,49.33 C14.2 4.45,49.53 3.81,48.9 3.81,40.01 4.17,39.65 IC6.1 | 19.1,49.33 20.17,48.26 | 20.17,47.55 U$5.GND | C10.2 C6.2 21.59,67.31 20.95,66.67 15.24,66.67 13.97,67.94 R1.1 13.34,68.58 12.7,69.22 12.7,76.35 12.14,76.91 12.7,77.47 12.7,90.05 | C7.2 48.9,80.64 49.53,81.28 C3.1 | LCD_L.5 84.45,76.83 83.82,77.47 83.82,88.27 83.19,88.9 C11.2 80.01,88.27 77.47,88.27 76.83,87.63 U$3.P$1 | LED.7 89.53,64.14 90.17,63.5 90.17,46.99 89.53,46.35 LCD_H.8 | IC2.20 64.77,29.21 65.41,28.57 65.41,26.04 66.04,25.4 69.22,25.4 69.85,24.77 69.85,10.79 70.48,10.16 78.11,10.16 78.74,9.53 IC4.14
GPIO2  (via drill 0.64)
  Top 0.406: v66.75,63.91 64.62,66.04 43.81,66.04 43.18,65.41 43.18,61.16 v43.28,61.06 | v31.55,50.75 21.59,50.75 20.88,51.46 19.81,51.46 19.1,50.75 19.1,48.85 U$5.GPIO2 17.78,47.53 17.78,41.91 15.88,40.01 15.24,40.01 14.61,39.37 R19.2
  Bottom 0.406: v31.55,50.75 31.55,51.82 32.97,53.24 42.44,53.24 43.18,53.98 43.18,60.96 v43.28,61.06 | v66.75,63.91 74.52,63.91 74.93,63.5 74.93,52.7 75.56,52.07 IC2.30
HLDA
  Top 0.406: IC1.38 49.68,72.44 55.02,72.44 SL4.3
HOLD
  Top 0.406: SL4.2 IC1.39 47.62,74.93 46.99,75.56 46.99,87 46.35,87.63 R4.1
INTA*
  Top 0.406: SL3.3 IC1.11
INTR
  Top 0.406: IC1.10 SL3.2 R5.1
IO/M*  (via drill 0.64)
  Top 0.406: IC5.2 IC5.1 9.53,3.81 8.89,4.45 8.89,6.99 8.26,7.62 2.54,7.62 1.68,8.48 1.68,32.26 2.39,32.97 5.23,32.97 5.28,33.02 6.35,33.02 8.89,35.56 8.89,52.7 9.53,53.34 17.04,53.34 17.68,53.98 17.68,62.76 18.41,63.5 39.75,63.5 v39.8,63.55 | SL4.7 IC2.7
  Bottom 0.406: SL4.7 55.02,62.13 49.68,62.13 IC1.34 49.33,62.48 48.26,63.55 v39.8,63.55
MR*
  Bottom 0.406: IC4.22 60.71,23.01 58.93,24.79 46.99,24.79 46.97,24.77 41.27,24.77 40.44,23.93 40.44,9.86 36.93,6.35 33.66,6.35 33.02,6.99 IC5.8
N$2
  Bottom 0.406: 69.24,87.38 U$3.P$3 69.22,83.19 69.85,82.55 81.92,82.55 82.55,81.92 82.55,72.39 83.19,71.75 LCD_L.3
N$4
  Top 0.406: R10.2 83.82,43.81 LCD_H.7
N$5  (via drill 3.81)
  other vias: 4.45,89.53
N$6  (via drill 3.81)
  other vias: 89.53,89.53
N$7
  Bottom 0.406: PW_LED.K 15.24,87.63 13.97,86.36 R1.2
N$8
  Bottom 0.406: IC5.3 22.86,6.35 23.5,6.99 29.84,6.99 30.48,7.62 IC5.9
N$9  (via drill 0.64)
  Top 0.406: v19.1,5.59 19.46,5.59 19.81,5.94 29.62,5.94 30.48,5.08 IC5.6
  Bottom 0.406: v19.1,5.59 19.1,12.7 19.81,13.41 20.88,13.41 21.59,12.7 21.59,10.21 22.3,9.5 25.86,9.5 27.64,11.28 IC5.10
N$10  (via drill 3.81)
  other vias: 89.53,4.45
N$11  (via drill 3.81)
  other vias: 4.45,4.45
PB2
  Top 0.406: IC2.31 84.45,54.61 85.09,53.98 85.09,52.07 85.72,51.44 LED.2
PB3
  Top 0.406: IC2.32 84.53,57.15 85.09,56.59 85.09,55.24 86.36,53.98 LED.3
PB4
  Top 0.406: IC2.33 78.84,59.64 84.53,59.64 85.42,58.75 85.42,57.45 86.36,56.52 LED.4
PB5
  Top 0.406: IC2.34 78.84,62.13 84.53,62.13 85.08,61.58 85.08,60.34 85.72,59.69 87,59.69 LED.5
PB6
  Top 0.406: IC2.35 78.84,64.62 84.53,64.62 85.09,64.06 85.09,62.87 85.72,62.23 87,62.23 LED.6
RD*  (via drill 0.64)
  Top 0.406: IC5.4 IC5.5 27.94,2.54 28.8,1.68 82.96,1.68 83.46,2.18 v83.46,9.86 | IC1.32 SL5.1 IC2.9
  Bottom 0.406: v83.46,9.86 83.46,35.56 81.28,37.74 81.28,41.91 80.01,43.18 74.3,43.18 73.66,43.81 73.66,56.52 73.03,57.15 IC2.9
READY
  Top 0.406: SL4.6 IC1.35
  Bottom 0.406: SL4.6 60.33,64.77 60.96,65.41 R3.1
RS
  Top 0.406: IC2.37 78.84,69.95 81.92,69.95 82.55,70.59 82.55,73.66 83.19,74.3 LCD_L.4
RST5.5
  Top 0.406: R6.1 SL3.1 IC1.9
  Bottom 0.406: TIMER.2 31.19,84.89 31.19,57.71 31.75,57.15 IC1.9
RST6.5
  Top 0.406: R7.1 SL2.8 IC1.8
  Bottom 0.406: PIR.2 3.81,31.9 2.74,32.97 2.39,32.97 1.68,33.68 1.68,51.84 2.01,52.17 17.25,52.17 17.78,52.7 17.78,59.05 18.41,59.69 R7.1
RST7.5
  Top 0.406: IC1.7 SL2.7 R8.1 19.05,62.23 18.39,61.57 18.39,52.53 16.61,50.75 16.61,48.62 15.54,47.55 U$5.GPIO0 15.24,47.53 15.24,41.27 14.61,40.64 12.06,40.64 11.43,40.01 R20.2
RST_IN
  Top 0.406: IC1.36 SL4.5 | RESET.3 RESET.4 50.52,89.89 C3.2
  Bottom 0.406: IC1.36 50.8,67.31 51.44,67.94 51.44,71.73 51.46,71.75 51.46,84.45 51.44,84.48 51.44,88.27 50.8,88.9 C3.2 48.26,88.9 47.62,88.27 47.62,85.72 46.99,85.09 R2.1
RST_OUT
  Top 0.406: IC2.4 62.18,68.53 45.14,68.53 44.45,69.22 44.45,71.75 43.81,72.39 IC1.3 SL2.3
S0
  Top 0.406: IC1.29 SL5.4
S1
  Top 0.406: IC1.33 SL4.8
SID
  Top 0.406: SL2.5 IC1.5
  Bottom 0.406: U$5.TX 22.15,50.09 23.01,50.95 | 23.01,50.95 23.01,46.78 22.3,46.06 22.3,37.17 21.96,36.83 R12.1 | SL2.5 23.5,67.31 23.01,66.83 23.01,50.95
SOD
  Top 0.406: R18.2 19.05,38.1 20.32,38.1 20.95,38.73 20.95,42.65 26.57,48.26 35.46,48.26 36.83,49.63 36.83,60.96 37.47,61.59 41.27,61.59 41.91,62.23 41.91,69.22 41.27,69.85 IC1.4 SL2.4
  Bottom 0.406: U$5.RX 13.06,47.19 13.06,46.13 13.46,45.72 17.14,45.72 17.68,45.19 17.68,36.88 R18.2
TIMER_OUT
  Bottom 0.406: TIMER.1 34.11,87.81 35.66,86.26 37.31,86.26 38.1,85.47 38.1,66.67 38.73,66.04 50.75,66.04 53.29,63.5 62.23,63.5 IC2.6
TRAP
  Top 0.406: IC1.6 SL2.6 R9.1
VCC  (via drill 0.64)
  Top 0.406: 4.88,54.66 C2.1 4.88,54.3 | 3.81,62.13 C1.+ | 3.81,34.39 PIR.3 | 53.59,80.97 R3.2 | 48.26,23.01 IC4.27 | 45.77,23.01 IC4.28 | 55.24,78.56 SL4.1 | 81.58,19.46 81.59,19.47
  Top 0.61: 4.88,54.66 4.88,61.06 3.81,62.13 | 17.68,11.28 IC5.14 15.24,11.43 14.61,10.79 C4.1 | 4.88,54.3 4.88,35.46 3.81,34.39 | 45.77,23.01 48.26,23.01 | POWER.2 10.03,86.49 | 10.03,86.49 11.43,85.09 15.24,85.09 16.51,86.36 16.51,88.9 17.78,90.17 PW_LED.A 34.29,90.17 34.92,89.53 34.92,85.72 35.56,85.09 R2.2 40.01,85.09 40.64,84.45 C7.1 | 10.03,86.49 10.03,69.22 9.4,68.58 4.45,68.58 3.81,67.94 C1.+ | C5.1 6.99,23.5 7.62,24.13 IC3.20 | IC1.40 49.53,80.64 50.16,81.28 R3.2 54.61,81.28 55.24,80.64 SL4.1 | 55.24,78.56 55.88,79.2 71.58,79.2 72.39,80.01 C8.1 72.44,80.97 75.29,80.97 76.86,82.55 80.01,82.55 80.64,83.19 C11.1 U$3.P$2 | 81.59,19.47 88.68,19.47 89.86,20.65 89.86,48.26 89.23,48.9 LED.1 | v64.62,19.46 81.58,19.46
  Bottom 0.406: C8.1 72.44,80.62 72.39,80.57 | C4.1 8.89,8.89 8.43,9.35 8.43,20.78 7.62,21.59 C5.1 | 10.16,24.38 IC3.20 | C7.1 40.64,78.11 41.27,77.47 IC1.40 | 85.6,66.17 85.09,66.67 | C1.+ 3.81,66.67 4.45,67.31
  Bottom 0.61: C9.1 42.22,16.61 42.22,19.46 45.41,22.66 IC4.28 | 85.6,66.17 85.6,49.66 86.36,48.9 LED.1 | v64.62,19.46 51.46,19.46 48.26,22.66 IC4.27 | PIR.3 6.99,34.29 7.62,33.66 7.62,31.29 10.16,28.75 IC3.20 | 10.16,24.38 12.7,26.92 12.7,30.4 10.16,32.94 10.16,43.81 9.75,44.22 IC6.3 | LCD_L.1 85.09,66.67 81.92,66.67 81.28,67.31 81.28,76.83 80.64,77.47 IC2.40 73.03,77.47 72.39,78.11 72.39,80.57 | 4.45,67.31 9.53,67.31 10.16,67.94 10.16,72.39 9.6,72.95 U$2.VBUS
WR*
  Top 0.406: IC2.10 SL5.2 IC1.31
X1
  Top 0.406: C10.1 19.1,83.82 19.1,78.84 Q1.2 19.1,78.49 26.92,78.49 SL2.1 27.99,77.42 34.04,77.42 IC1.1
X2
  Top 0.406: C6.1 19.1,68.89 19.1,73.51 Q1.1 19.1,73.86 26.57,73.86 27.64,74.93 SL2.2 IC1.2

### Text on the board
tNames: Manoj Sahu | Agarwal | Udit Kumar | 93/EC/15 | 188/EC/15 | 8085 BASED | SMART MIRROR
bNames: UDIT KUMAR AGARWAL